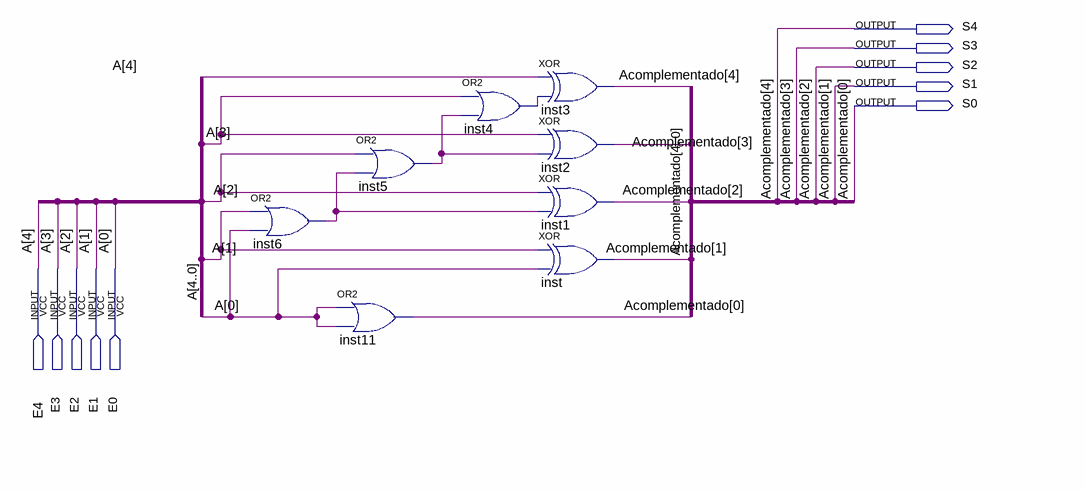
[diagram p0: schematic sheet]
// Quartus schematic complementador_de_2_antigo.bdf as structural Verilog: 8 symbols, 10 pins
module complementador_de_2_antigo (
  input  E4,
  input  E3,
  input  E2,
  input  E1,
  input  E0,
  output S4,
  output S3,
  output S2,
  output S1,
  output S0
);

  wire inst4_out, inst5_out, inst6_out;

  or inst6 (inst6_out, E1, E0);
  or inst11 (S0, E0, E0);
  or inst5 (inst5_out, E2, inst6_out);
  or inst4 (inst4_out, E3, inst5_out);
  xor inst3 (S4, E4, inst4_out);
  xor inst2 (S3, E3, inst5_out);
  xor inst1 (S2, E2, inst6_out);
  xor inst (S1, E1, E0);

  // Other names for the same wires on the sheet: A[4:0] = {E4, E3, E2, E1, E0};
  //   Acomplementado[4:0] = {S4, S3, S2, S1, S0}
endmodule
